# Altium schematic sheet Sheet1.SchDoc
size A4; SheetNumber: 1; SheetTotal: 1
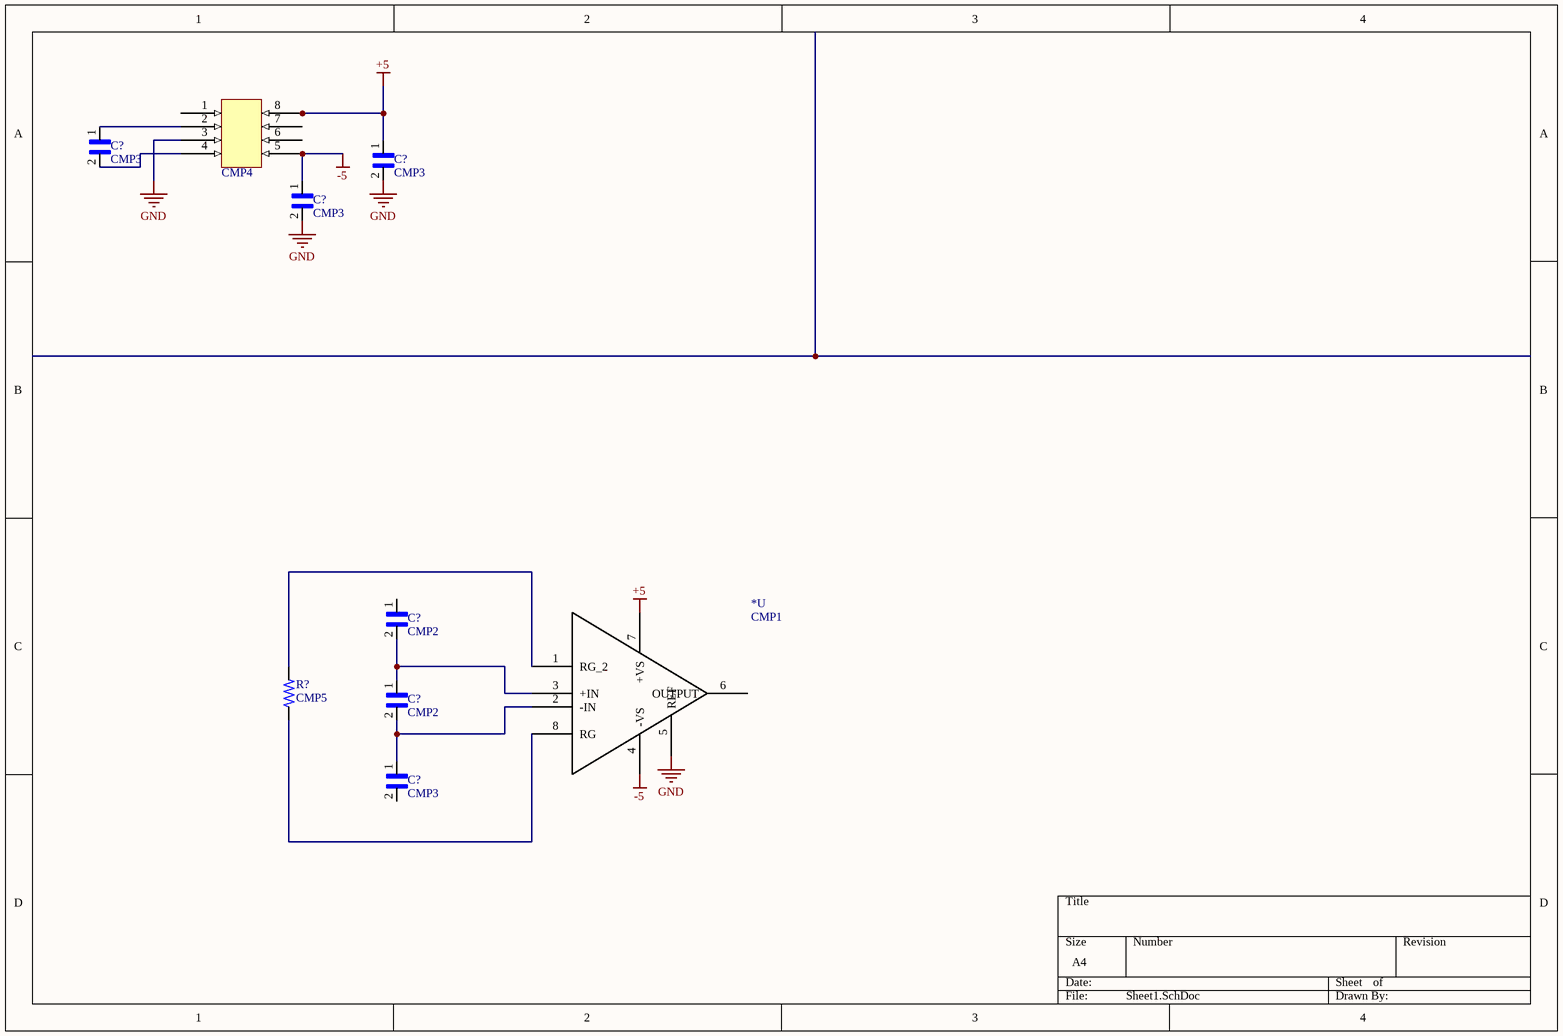
[diagram p0: Sheet1.SchDoc]

## Parts
(Parts that share a designator on the sheet are numbered #1, #2 ... from top to bottom, then left to right.)
*U  CMP1  [AD627 8-SOIC]
?  CMP4  [Charge pump +/-5v]
C?#1  CMP3  [CAP 0603]
C?#2  CMP3  [CAP 0603]
C?#3  CMP3  [CAP 0603]
C?#4  CMP2  [CAP 0805]
C?#5  CMP2  [CAP 0805]
C?#6  CMP3  [CAP 0603]
R?  CMP5  [RES 0805]

## Nets
+5: *U.7(+VS) ?.8 C?#2.1
-5: *U.4(-VS) ?.5 C?#3.1
GND: *U.5(REF) ?.3 C?#2.2 C?#3.2
Net*U_1: *U.1(RG_2) R?.2
Net*U_2: *U.2(-IN) C?#5.2 C?#6.1
Net*U_3: *U.3(+IN) C?#4.2 C?#5.1
Net*U_8: *U.8(RG) R?.1
Net?_2: ?.2 C?#1.1
Net?_4: ?.4 C?#1.2

Not connected (* = marked no-connect by the designer): *U 6(OUTPUT); ? 1 6 7; C?#4 1; C?#6 2

## Library data of the parts
*U = CMP1: Instrumentation Amplifier AD627; MP: AD627AR; MF: Analog Devices; Price: None; Availability: Warning; Package: SOIC-8 Analog Devices; DigiKey-Purchase-URL: https://snapeda.com/shop?store=DigiKey&id=558411; Value: *; SnapEDA_Link: https://www.snapeda.com/parts/AD627AR/Analog%20Devices%20Inc./view-part/558411/?ref=snap; ComponentLink1Description: New link; ComponentLink1URL: http://www.tme.vn/Product.aspx?id=2272&fbclid=IwAR1r3-aYSaNjoE7f3PSriBxNBMmIgj82tOKJ_9gO5Z10qRkidb9YGGOgiqw#page=pro_info; Parameter 1: *
? = CMP4: Charge pump
C?#1-C?#3 C?#6 = CMP3: CAP 0603; MP: CC0603KRX5R9BB105; Package: None; Price: None; Value: *; Availability: Unavailable
C?#4 C?#5 = CMP2: CAP 0805; MF: Yageo; MP: CC0805KKX5R7BB106; Price: None; Package: 0805 Yageo; Purchase-URL: https://pricing.snapeda.com/search/part/CC0805KKX5R7BB106/?ref=eda; Availability: In Stock; SnapEDA_Link: https://www.snapeda.com/parts/CC0805KKX5R7BB106/Yageo/view-part/?ref=snap; Value: *; Check_prices: https://www.snapeda.com/parts/CC0805KKX5R7BB106/Yageo/view-part/?ref=eda
R? = CMP5: Res; MP: 1879462-3; Package: None; Price: None; Value: *; Availability: Unavailable